# Altium schematic sheet Ammeter Design.SchDoc
size A; SheetNumber: 3; SheetTotal: 10
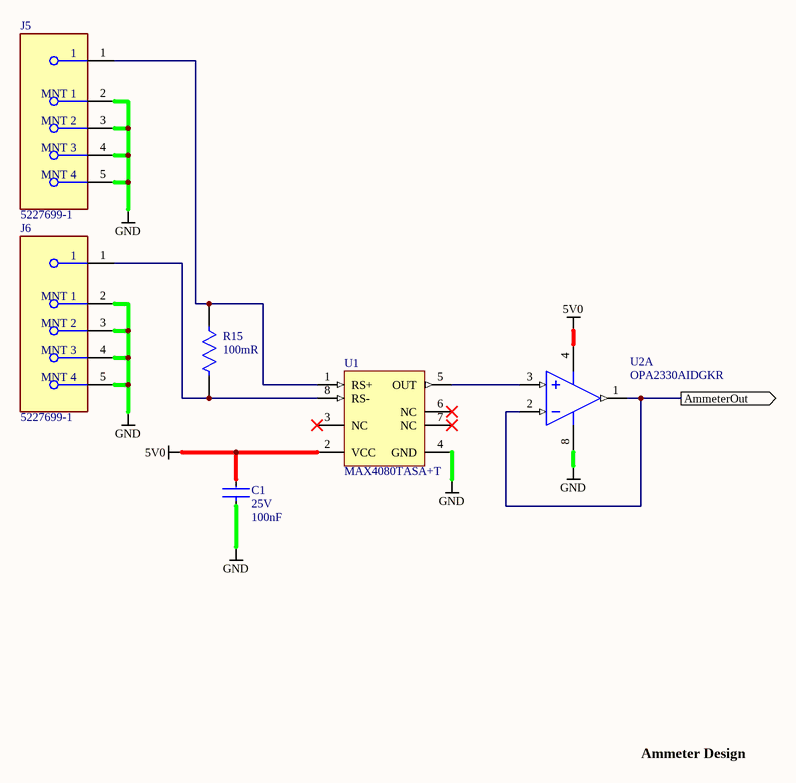
[diagram p0: Ammeter Design.SchDoc]

## Parts
C1  Voltage: 25V  Capacitance: 100nF  [FP-CL278-IPC_C]  (hidden comment: 0.1 uF_CL05A104KA5NNNC)
J5  5227699-1  [FP-5227699-1-MFG]
J6  5227699-1  [FP-5227699-1-MFG]
R15  Resistance: 100mR  [FP-CSR1206-IPC_B]  (hidden comment: 0.1 Ohm)
U1  MAX4080TASA+T  [MAXM-S8+2_M]
U2  OPA2330AIDGKR  [DGK0008A_M]  (part A of 2)

## Ports
AmmeterOut (out)

## Nets
5V0: C1.2 U1.2(VCC) U2.4(V-)
GND: C1.1 J5.2(MNT_1) J5.3(MNT_2) J5.4(MNT_3) J5.5(MNT_4) J6.2(MNT_1) J6.3(MNT_2) J6.4(MNT_3) J6.5(MNT_4) U1.4(GND) U2.8(V+)
AmmeterOut: U2.1(OUT_A) U2.2(IN_A-) ; port AmmeterOut
NetJ5_1: J5.1 R15.1 U1.1(RS+)
NetJ6_1: J6.1 R15.2 U1.8(RS-)
NetU1_5: U1.5(OUT) U2.3(IN_A+)

Not connected (* = marked no-connect by the designer): U1 3(NC)* 6(NC)* 7(NC)*

## Notes on the sheet
- Ammeter Design

## Library data of the parts
C1 = CMP-13271-000728-1: Cap Ceramic 100nF 25V X5R ±10% SMD 0402 +85°C Paper T/R; Package Quantity: 1; Height: 0.5mm; Case Code (Metric): 1005; Thickness: 0.022inch; Mount: Surface Mount; Lead Free: Lead Free; Case Code (Imperial): 0402; Packaging: Tape and Reel; Depth: 0.5mm; Min Operating Temperature: -55°C; Voltage Rating: 25V; Dielectric: X5R; Case/Package: 0402; Tolerance: 10%; Width: 0.02inch; Max Operating Temperature: 85°C; Length: 1mm; Radiation Hardening: No; Voltage Rating (DC): 25V
J5 J6 = CMP-03357-000003-1: CONN BNC JACK STR 50 OHM PCB; Frequency: 4GHz; Number of Positions: 1; Body Plating: Nickel; Gender: Female; PCB Mount Retention: Without; Polarity: Standard; Body Material: Zinc; Voltage Rating: 500V; Sealable: No (Without); PCB Mounting Orientation: Vertical; Impedance: 50R; Insulation Resistance: 5GR; Orientation: Straight; Package Quantity: 30; ELV: Compliant; Min Operating Temperature: -55°C; Length: 17.45mm; Termination: Solder; Connector Type: BNC; Fastening Type: Bayonet; Contact Plating: Silver; Depth: 17.45mm; Contact Material: Bronze; Max Frequency: 4GHz; Max Operating Temperature: 85°C; Radiation Hardening: No; Mount: Through Hole; Lead Free: Lead Free; Packaging: Rail/Tube
R15 = CMP-26527-000321-1: General Purpose Thick Film Chip Resistor, 1206, 0.1Ω, 1%, 100ppm/°C, 0.5W; Power Rating: 500mW; Number of Terminations: 2; Military Standard: Not; Radiation Hardening: No; Case Code (Metric): 3216; Tolerance: 1%; Resistor Type: Thick Film; Min Operating Temperature: -55°C; RoHS Compliant: Yes; Length: 0.12inch; Depth: 1.55mm; Width: 0.061inch; Max Operating Temperature: 155°C; Contact Plating: Tin; Size Code: 1206; Series: CSR; Case/Package: 1206; Temperature Coefficient: 100ppm/°C; Lead Free: Lead Free; Height: 0.026inch; Max Power Dissipation: 500mW; Case Code (Imperial): 1206; Packaging: Tape and Reel; Mount: Surface Mount; Construction: Rectangular
U1 = CMP-0252-00170-1: 76 V, High-Side, Uni-directional Current-Sense Amplifier, 20 V / V Gain, -40 to 125 degC, 8-Pin SOIC (S8+2), Pb-Free, Tape and Reel; Bi-Dir. Curr. Sense: No; Industry Qualified: Automotive - AECQ100, Automotive - General; Gain: 5 V/V, 20 V/V ,60 V/V; DatasheetVersion: Rev. 4; ComponentLink3Description: Package Specification; ComponentLink1URL: http://www.maximintegrated.com/; ComponentLink3URL: http://pdfserv.maximintegrated.com/package_dwgs/21-0041.PDF; PackageVersion: Rev. D, 10/2012; Code_JEDEC: MS012; PartNumber: MAX4080TASA+T; ComponentLink2Description: Datasheet; ComponentLink1Description: Manufacturer URL; Mounting Technology: Surface Mount; ComponentLink2URL: http://datasheets.maximintegrated.com/en/ds/MAX4080-MAX4081.pdf; PackageDescription: 8-Pin Small-Outline IC, Narrow (0.15in) (S8+2), Body 4.90 x 3.90 mm, Pitch 1.27 mm; PackageReference: S8+2
U2 = CMP-0272-01264-3: 35 uA, MicroPower, Precision, Zero Drift CMOS Operational Amplifier, 1.8 to 5.5 V, -40 to 125 degC, 8-pin SOP (DGK8), Green (RoHS & no Sb/Br); Manufacturer: Texas Instruments; Total Supply Voltage(Max)(+5V is 5, +/-5V is 10): 5.5; CMRR(Min)(dB): 100; Number of Channels: 2; IIB(Max)(pA): 500; Total Supply Voltage(Min)(+5V is 5, +/-5V is 10): 1.8; Sub Family: Low Offset Voltage Amplifier (<=500uV), Low Power Amp (<=500uA), Low Supply Voltage Amplifier (<=2.7V), Precision Amplifier, Zero Drift Precision Amplifier; Offset Drift(Typ)(uV/C): 0.02; Slew Rate(Typ)(V/us): 0.16; Vn at 1kHz(Typ)(nV/rtHz): 55; Iq per channel(Max)(mA): 0.035; Vio (25C)(Max)(mV): 0.05; PackageReference: DGK0008A; ComponentLink3Description: Package Specification; Mounting Technology: Surface Mount; DatasheetVersion: SBOS432E; PackageVersion: 4073329/E, 05/2006; PackageDescription: 8-Pin Thin Small Outline, Body 3 x 3 mm, Pitch 0.65 mm; ComponentLink2URL: http://www.ti.com/general/docs/lit/getliterature.tsp?genericPartNumber=OPA2330&fileType=pdf; ComponentLink1URL: http://www.ti.com/; Eco-Plan: Green (RoHS & no Sb/Br); Code_JEDEC: MO-187; ComponentLink2Description: Datasheet; ComponentLink3URL: http://www.ti.com/litv/pdf/mpds028d; PartNumber: OPA2330AIDGKR; ComponentLink1Description: Manufacturer URL